# EAGLE design Magnet (EAGLE 7.5.0)
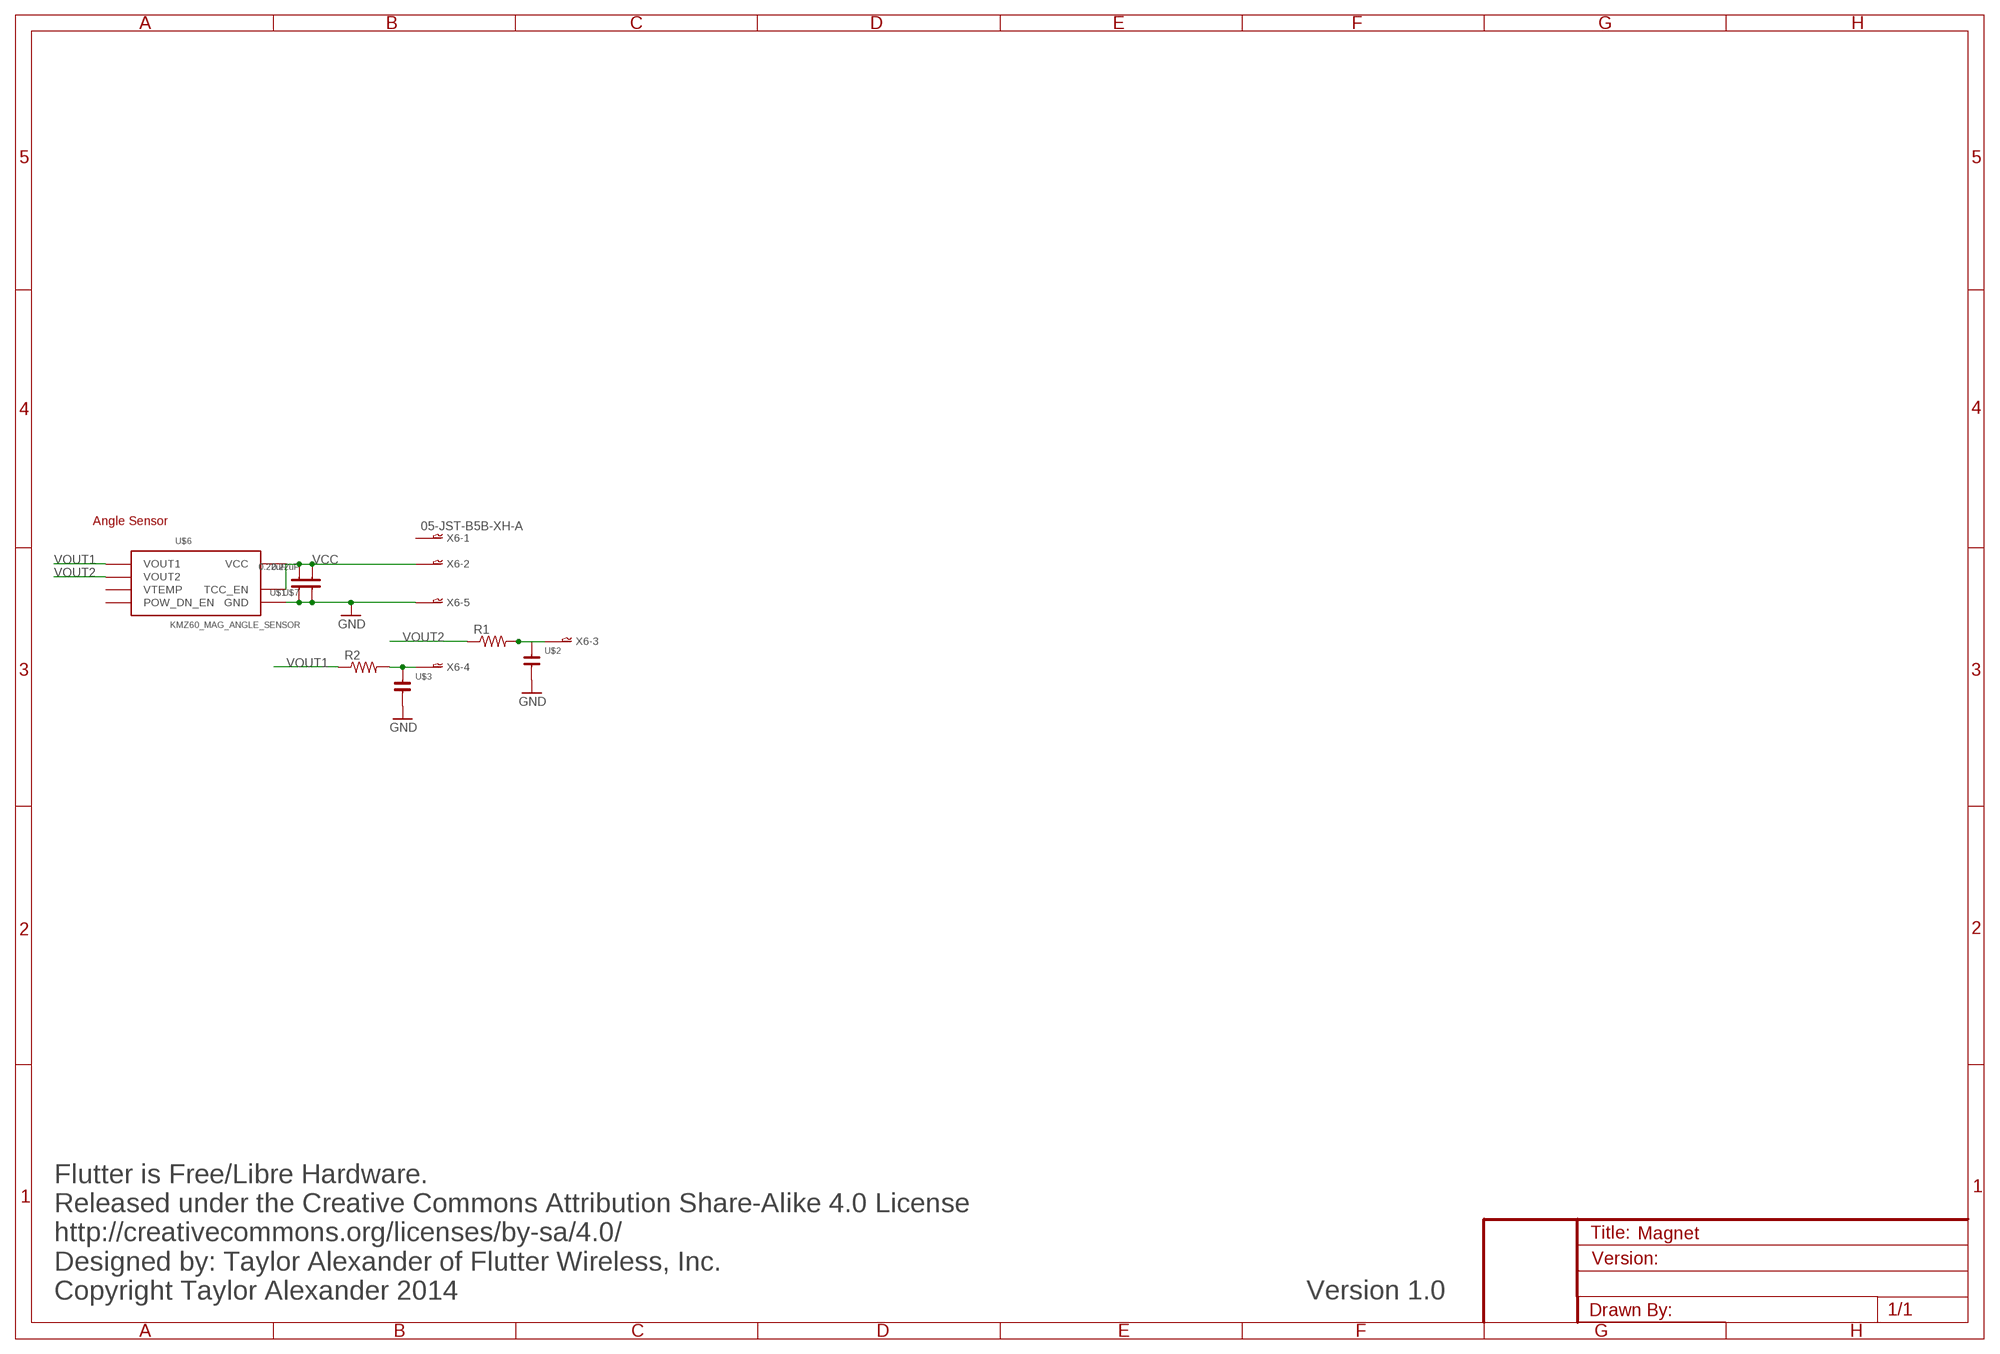
[diagram p0: schematic, sheet 1]

## Parts
R1  RESISTOR0603  [0603-RES]
R2  RESISTOR0603  [0603-RES]
U$1  0.22uF  CAPACITOR0805  [0808-CAP]
U$2  CAPACITOR0603-CAP  [0603-CAP]
U$3  CAPACITOR0603-CAP  [0603-CAP]
U$6  KMZ60_MAG_ANGLE_SENSOR  [SO-8]
U$7  0.22uF  CAPACITOR0805  [0808-CAP]
X6  05-JST-B5B-XH-A  [B5B-XH]

## Nets
GND: U$1.1 U$2.2 U$3.2 U$6.P$3(GND) U$6.P$6(GND) U$7.1 X6.P$5
N$5: R2.2 U$3.1 X6.P$4
N$6: R1.2 U$2.1 X6.P$3
VCC: U$1.2 U$6.P$1(TCC_EN) U$6.P$7(VCC) U$7.2 X6.P$2
VOUT1: R2.1 U$6.P$2(VOUT1)
VOUT2: R1.1 U$6.P$4(VOUT2)
Unconnected: U$6.P$5(VTEMP) U$6.P$8(POW_DN_EN) X6.P$1

## Notes on the sheet
- Angle Sensor
- Flutter is Free/Libre Hardware.
  Released under the Creative Commons Attribution Share-Alike 4.0 License
  http://creativecommons.org/licenses/by-sa/4.0/
  Designed by: Taylor Alexander of Flutter Wireless, Inc.
  Copyright Taylor Alexander 2014
- Version 1.0

## Library data of the parts
R1 R2 = Taylor:RESISTOR: Resistor Basic schematic elements and footprints for 0603, 1206, and PTH 1/10th watt (small) resistors.
U$1-U$3 U$7 = Taylor:CAPACITOR
U$6 = Taylor:KMZ60_MAG_ANGLE_SENSOR
X6 = con-jst-xh:05-JST: JST CONNECTOR

## Net classes
0 default: width 0.152 mm, drill 0.152 mm, clearance 0.102 mm
1 Power: width 0.203 mm, drill 0.152 mm, clearance 0.102 mm

## Board
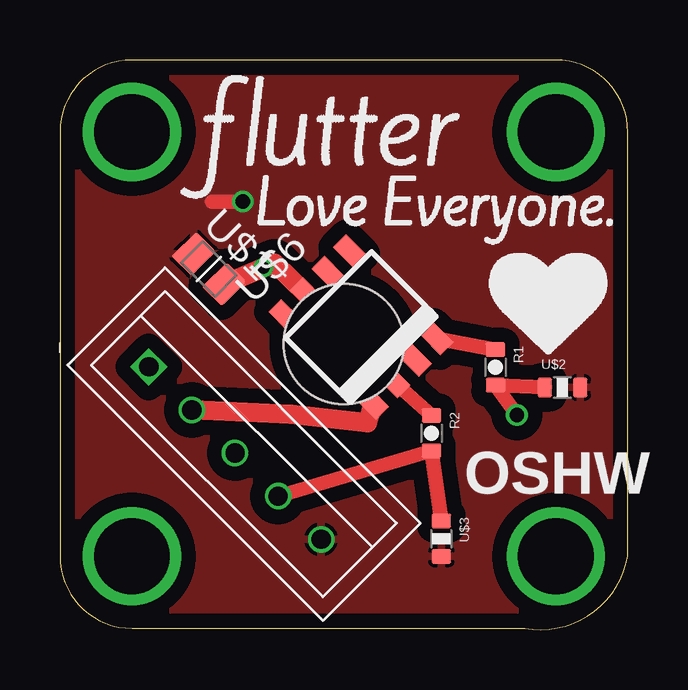
[diagram p1: board, top side]
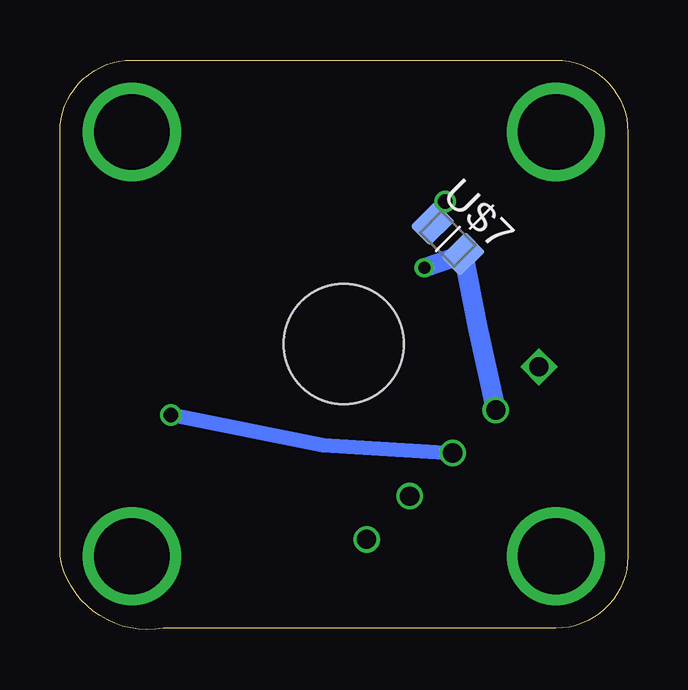
[diagram p2: board, bottom side, seen from below]

Size 23.68 x 23.74 mm. Coordinates in mm from the lower left corner, seen from the top.
Outline: 0,20.74 0,3.06 arc90 3,0.06 19.38,0.06 arc90 23.68,3.06 23.68,20.74 arc90 20.68,23.74 3,23.74 arc90 0,20.74
Copper layers (1*16): Top 0.035mm / dielectric 1.5mm / Bottom 0.035mm
Design rules "taylor design rules": minimum track width 3mil, minimum drill 7mil, track to track 6mil, track to pad 6mil, pad to pad 6mil, via to via 6mil, smd to smd 0mil, copper to edge 6mil, drill to drill 6mil, minimum pad ring 6mil, minimum via ring 6mil, stop-mask expansion 4mil, vias tented up to drill 25mil, thermal gap 6mil
Holes 5 mm at 11.84,11.9

### Footprints (pad centres in the part's own frame; a part is rotated, then mirrored left to right if it is on the bottom)
0603-RES = smd 0.6 x 0.8: 1 -0.74,0; 2 0.74,0
0808-CAP = smd 1.15 x 1.45: 1 -0.9,0; 2 0.9,0
0603-CAP = smd 0.6 x 0.8: 1 -0.74,0; 2 0.74,0
SO-8 = smd 0.762 x 1.143: P$1 -1.905,-2.603; P$2 -0.635,-2.603; P$3 0.635,-2.603; P$4 1.905,-2.603; P$5 1.905,2.603; P$6 0.635,2.603; P$7 -0.635,2.603; P$8 -1.905,2.603
B5B-XH = drill 0.8 square: P$1 -5.08,0 | drill 0.8: P$2 -2.54,0; P$3 0,0; P$4 2.54,0; P$5 5.08,0

### Placement (x,y rotation side)
R1  18.16,10.93 270 top
R2  15.49,8.19 270 top
U$1  6.2,15.03 315 top
U$2  20.95,10.09 0 top
U$3  15.9,3.79 270 top
U$6  12.55,12.61 45 top
U$7  7.5,16.28 315 bottom
X6  7.3,7.36 315 top

### Tracks (layer width: path | path; a pad name or v marks a point on that pad's centre or on a via)
GND  (via drill 0.6)
  Top 0.61: v7.62,17.84 6.35,17.84
  Bottom 0.61: U$7.1 v7.62,17.84
  pour Top (isolate 0.61): 0,24.19 24.13,24.19 24.13,0.06 0,0.06
N$1  (via drill 3.15)
  other vias: 3,20.74
N$2  (via drill 3.15)
  other vias: 20.68,3.06
N$3  (via drill 3.15)
  other vias: 20.68,20.74
N$4  (via drill 3.15)
  other vias: 3,3.06
N$5
  Top 0.61: U$3.1 R2.2 X6.P$4
N$6  (via drill 0.6)
  Top 0.61: U$2.1 R1.2 v19.05,8.95
  Bottom 0.61: v19.05,8.95 12.7,7.68 X6.P$3
VCC  (via drill 0.5)
  Top 0.813: U$1.2 v8.48,15.08 8.95,15.27 U$6.P$7 | X6.P$2 9.63,8.97 12.83,8.62 U$6.P$1
  Bottom 0.813: X6.P$2 6.25,12.56 U$7.2 v8.48,15.08
VOUT1
  Top 0.61: R2.1 U$6.P$2
VOUT2
  Top 0.61: U$6.P$4 R1.1

### Text on the board
tPlace: OSHW
tNames: Released under the Creative Commons Attribution Share-Alike 4.0 License / http://creativecommons.org/licenses/by-sa/4.0/ / Designed by: Taylor Alexander of Flutter Wireless, Inc.